# Altium schematic sheet ADC.SchDoc
size A4
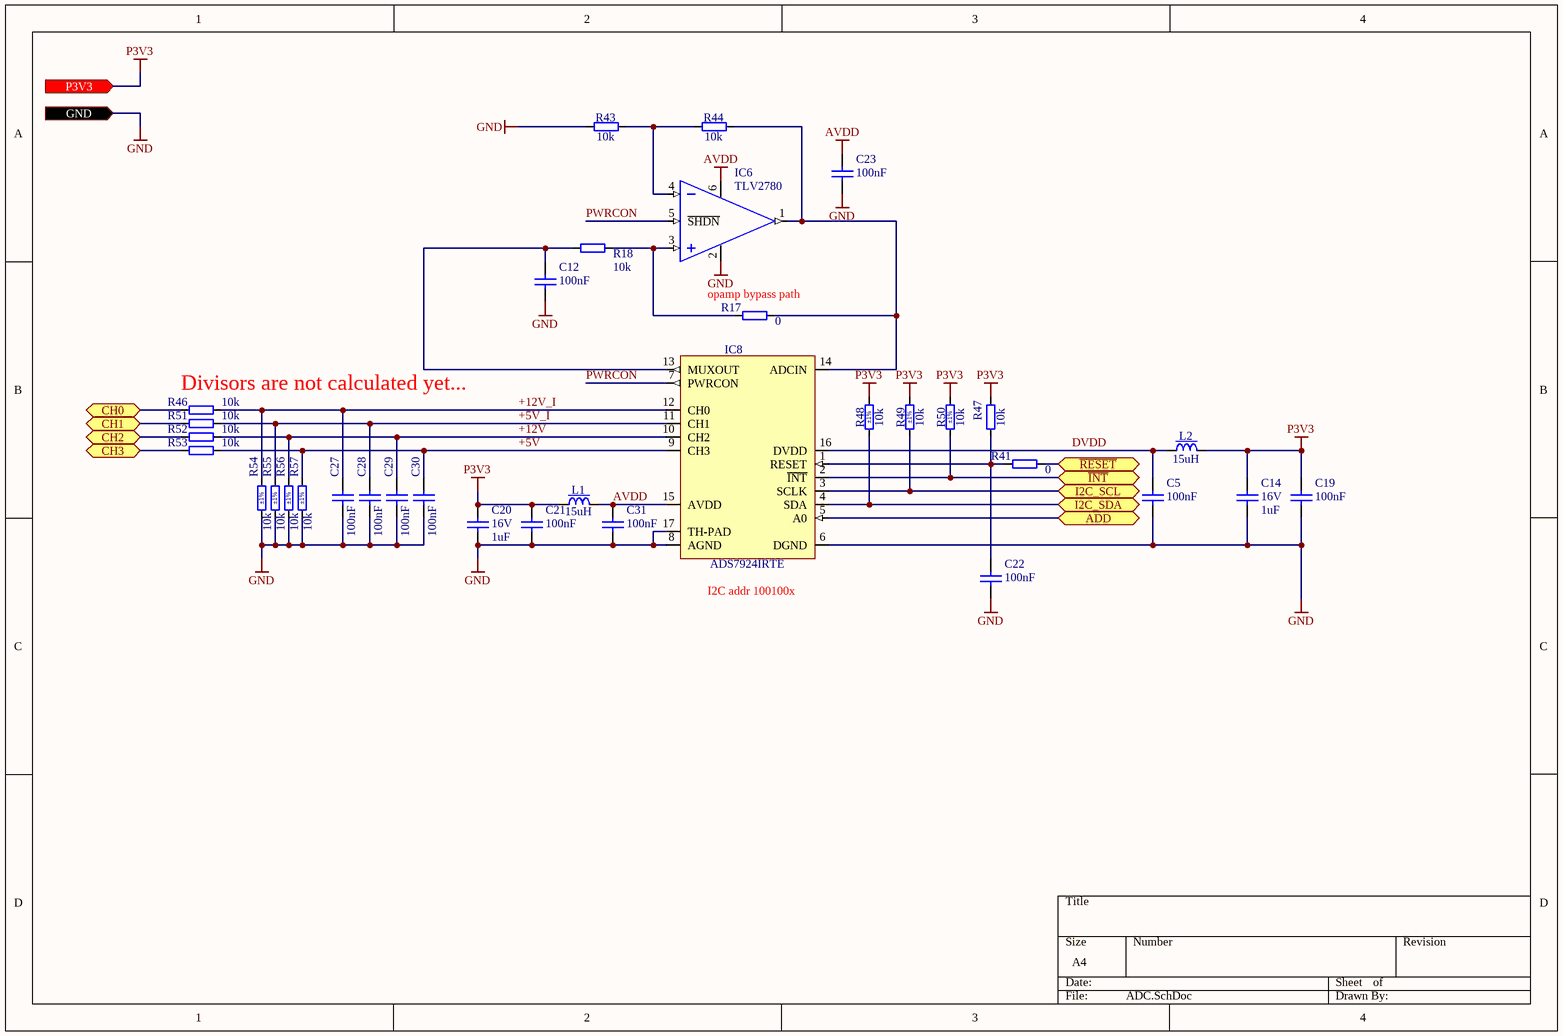
[diagram p0: ADC.SchDoc]

## Parts
C5  100nF  [CAPC1608X87N]
C12  100nF  [CAPC1608X87N]
C14  1uF  Voltage: 16V  [CAPC1608X87N]
C19  100nF  [CAPC1608X87N]
C20  1uF  Voltage: 16V  [CAPC1608X87N]
C21  100nF  [CAPC1608X87N]
C22  100nF  [CAPC1608X87N]
C23  100nF  [CAPC1608X87N]
C27  100nF  [CAPC1608X87N]
C28  100nF  [CAPC1608X87N]
C29  100nF  [CAPC1608X87N]
C30  100nF  [CAPC1608X87N]
C31  100nF  [CAPC1608X87N]
IC6  TLV2780  [SOT95P280X145-6N]
IC8  ADS7924IRTE  [WQFN-16]
L1  15uH  [IND_COILCRAFT_0603LS]
L2  15uH  [IND_COILCRAFT_0603LS]
R17  0  [RESC1608X55N]
R18  10k  [RESC1608X55N]
R41  0  [RESC1608X55N]
R43  10k  [RESC1608X55N]
R44  10k  [RESC1608X55N]
R46  10k  [RESC1608X55N]
R47  10k  [RESC1608X55N]
R48  10k  Tolerance: ±1%  [RESC1608X55N]
R49  10k  Tolerance: ±1%  [RESC1608X55N]
R50  10k  Tolerance: ±1%  [RESC1608X55N]
R51  10k  [RESC1608X55N]
R52  10k  [RESC1608X55N]
R53  10k  [RESC1608X55N]
R54  10k  Tolerance: ±1%  [RESC1608X55N]
R55  10k  Tolerance: ±1%  [RESC1608X55N]
R56  10k  Tolerance: ±1%  [RESC1608X55N]
R57  10k  Tolerance: ±1%  [RESC1608X55N]

## Ports
ADD (bidir), CH0 (bidir), CH1 (bidir), CH2 (bidir), CH3 (bidir), GND (in), I2C_SCL (bidir), I2C_SDA (bidir), P3V3 (in), ~{INT} (bidir), ~{RESET} (bidir)

## Nets
AVDD: C23.1 C31.1 IC6.6(VDD) IC8.15(AVDD) L1.2
GND: C5.2 C12.2 C14.1 C19.2 C20.1 C21.2 C22.2 C23.2 C27.2 C28.2 C29.2 C30.2 C31.2 IC6.2(GND) IC8.6(DGND) IC8.8(AGND) IC8.17(TH-PAD) R43.1 R54.1 R55.1 R56.1 R57.1 ; port GND
P3V3: C14.2 C19.1 C20.2 C21.1 L1.1 L2.2 R47.2 R48.2 R49.2 R50.2 ; port P3V3
+5V: C30.1 IC8.9(CH3) R53.2 R57.2
+5V_I: C28.1 IC8.11(CH1) R51.2 R55.2
+12V: C29.1 IC8.10(CH2) R52.2 R56.2
+12V_I: C27.1 IC8.12(CH0) R46.2 R54.2
ADD: IC8.5(A0) ; port ADD
CH0: R46.1 ; port CH0
CH1: R51.1 ; port CH1
CH2: R52.1 ; port CH2
CH3: R53.1 ; port CH3
DVDD: C5.1 IC8.16(DVDD) L2.1
I2C_SCL: IC8.3(SCLK) R49.1 ; port I2C_SCL
I2C_SDA: IC8.4(SDA) R48.1 ; port I2C_SDA
~{INT}: IC8.2(~{INT}) R50.1 ; port ~{INT}
PWRCON: IC6.5(~{SHDN}) IC8.7(PWRCON)
~{RESET}: R41.2 ; port ~{RESET}
NetC12_1: C12.1 IC8.13(MUXOUT) R18.1
NetC22_1: C22.1 IC8.1(RESET) R41.1 R47.1
NetIC6_1: IC6.1(OUT) IC8.14(ADCIN) R17.2 R44.2
NetIC6_3: IC6.3(IN+) R17.1 R18.2
NetIC6_4: IC6.4(IN-) R43.2 R44.1

## Notes on the sheet
- (near R17) opamp bypass path <https://sklepelsat2.pl/mostek-do-tabliczki-zaciskowej-m5,132,1204.html>
- (near R46) Divisors are not calculated yet...
- (near IC8) I2C addr 100100x

## Library data of the parts
C5 C12 C19 C21-C23 C27-C31 = CC0603_100NF_50V_10%_X5R: Non-polarised capacitor; Part Description: SMD Multilayer Chip Ceramic Capacitor; Manufacturer: GENERIC; Manufacturer1 Part Number: C1608X5R1H104K080; Voltage: 50V; TC: X5R; Tolerance: ±10%; Part Number: CC0603_100NF_50V_10%_X5R; Component Kind: Standard; Component Type: Standard; Pin Count: 2; Value: 100nF; Status: None; Manufacturer Part Number: CC0603_100NF_50V_10%_X5R; Case: 0603; Mounted: Yes; Socket: No; SMD: Yes; Sense: No; Manufacturer1 Example: TDK; Manufacturer1 ComponentHeight: 0.9mm; HelpURL: \\cern.ch\dfs\Applications\Altium\Datasheets\CC0603_X5R_TDK_C.pdf; Author: CERN DEM MR; CreateDate: 08.01.2016; LatestRevisionDate: 08.01.2016
C14 C20 = CC0603_1UF_16V_10%_X7R: Non-polarised capacitor; Part Description: SMD Multilayer Chip Ceramic Capacitor; Manufacturer: GENERIC; Manufacturer1 Part Number: 223878615663; TC: X7R; Tolerance: ±10%; Part Number: CC0603_1UF_16V_10%_X7R; Component Kind: Standard; Component Type: Standard; Pin Count: 2; Value: 1uF; Status: None; Manufacturer Part Number: CC0603_1UF_16V_10%_X7R; Case: 0603; Mounted: Yes; Socket: No; SMD: Yes; Manufacturer1 Example: YAGEO PHYCOMP; Manufacturer1 ComponentHeight: 0.9mm; HelpURL: \\cern.ch\dfs\Applications\Altium\Datasheets\CC0603_X7R_PHYCOMP.pdf; Author: CERN DEM JLC; CreateDate: 03.12.2007; LatestRevisionDate: 17.04.2015; Sense: No
IC6 = TLV2780: General Purpose Amplifier 1 Circuit Rail-to-Rail SOT-23-6; Part Number: ADS7924IRTE; Part Description: ADS7924 2.2 V, 12-Bit, 4-Channel, MicroPOWER; Manufacturer: Texas Instruments; Manufacturer Part Number: TLV2780IDBVT; Table: Analog & Interface; Component Kind: Standard; Component Type: Standard; Device: TLV2780; Footprint: SOT-23-6; PackageDescription: SOT-23 - 1.45 mm max height; Pin Count: 6; Case: SOT-23-6; Mounted: Yes; Socket: No; SMD: Yes; ComponentHeight: 1.45mm; Author: LPA; HelpURL: https://www.ti.com/lit/ds/symlink/tlv2780.pdf?ts=1743037907792&ref_url=https%253A%252F%252Fwww.ti.com%252Fproduct%252FTLV2780%253FkeyMatch%253DTLV2780%2526tisearch%253Duniversal_search; CreateDate: 2025-03-27; LatestRevisionDate: 2025-03-27
IC8 = ADS7924: 12 Bit Analog to Digital Converter 4 Input 1 SAR 16-WQFN (3x3); Part Description: ADS7924 2.2 V, 12-Bit, 4-Channel, MicroPOWER; Manufacturer: Texas Instruments; Manufacturer Part Number: ADS7924IRTET; Table: Analog & Interface; Part Number: ADS7924IRTE; Component Kind: Standard; Component Type: Standard; Device: ADS7924IRTE; Footprint: 16-WQFN; PackageDescription: PLASTIC QUAD FLATPACK - NO LEAD; Pin Count: 16; Case: WQFN; Mounted: Yes; Socket: No; SMD: Yes; ComponentHeight: 0.8mm; Author: LPA; HelpURL: https://www.ti.com/lit/ds/symlink/ads7924.pdf?ts=1742979903157&ref_url=https%253A%252F%252Fwww.google.com%252F; CreateDate: 2025-03-27; LatestRevisionDate: 2025-03-27
L1 L2 = IND_15UH_5%_COILCRAFT_0603LS: Inductor With Core; Part Description: SMT Chip Inductor; Manufacturer Part Number: 0603LS-153XJL; Power: 170mA; Resistance: 7.1R; Tolerance: ±5%; Part Number: IND_15UH_5%_COILCRAFT_0603LS; Component Kind: Standard; Component Type: Standard; Pin Count: 2; Value: 15uH; Manufacturer: COILCRAFT; Case: 0603; Mounted: Yes; Socket: No; SMD: Yes; Sense: No; ComponentHeight: 1.12mm; HelpURL: \\cern.ch\dfs\Applications\Altium\Datasheets\IND_COILCRAFT_0603LS.pdf; Author: CERN DEM JMW; CreateDate: 15.06.2015; LatestRevisionDate: 15.06.2015
R17 R41 = R0603_0R_JUMPER: Resistor; Part Description: 1A (0.05R Max DC Resistance) Zero Ohm Jumper; Manufacturer: GENERIC; Manufacturer1 Part Number: NRC06Z0; PressFit: No; Part Number: R0603_0R_JUMPER; Component Kind: Standard; Component Type: Standard; Pin Count: 2; Value: 0; Status: Preferred; Manufacturer Part Number: R0603_0R_JUMPER; Case: 0603; Mounted: Yes; Sense: No; Socket: No; SMD: Yes; Manufacturer1 Example: NIC COMPONENT; Manufacturer1 ComponentHeight: 0.55mm; HelpURL: \\cern.ch\dfs\Applications\Altium\Datasheets\R0603_NIC_NRC.pdf; Author: CERN DEM JLC; CreateDate: 03.12.2007; LatestRevisionDate: 13.03.2008
R18 R43 R44 R46-R57 = R0603_10K_1%_0.1W_100PPM: Resistor - 1%; Part Description: General Purpose Thick Film Chip Resistor; Manufacturer: GENERIC; Manufacturer1 Part Number: NRC06F1002TRF; Power: 0.1W; TC: ±100ppm/°C; PressFit: No; Part Number: R0603_10K_1%_0.1W_100PPM; Component Kind: Standard; Component Type: Standard; Pin Count: 2; Value: 10k; Status: Preferred; Manufacturer Part Number: R0603_10K_1%_0.1W_100PPM; Case: 0603; Mounted: Yes; Sense: No; Socket: No; SMD: Yes; Manufacturer1 Example: NIC COMPONENT; Manufacturer1 ComponentHeight: 0.55mm; HelpURL: \\cern.ch\dfs\Applications\Altium\Datasheets\R0603_NIC_NRC.pdf; Author: CERN DEM JLC; CreateDate: 03.12.2007; LatestRevisionDate: 13.03.2008
  R18 R43 R44 R46 R47 R51-R53: Tolerance: ±1%